# EAGLE design PCB-BI8-1x10SC3 (EAGLE 7.5.0)
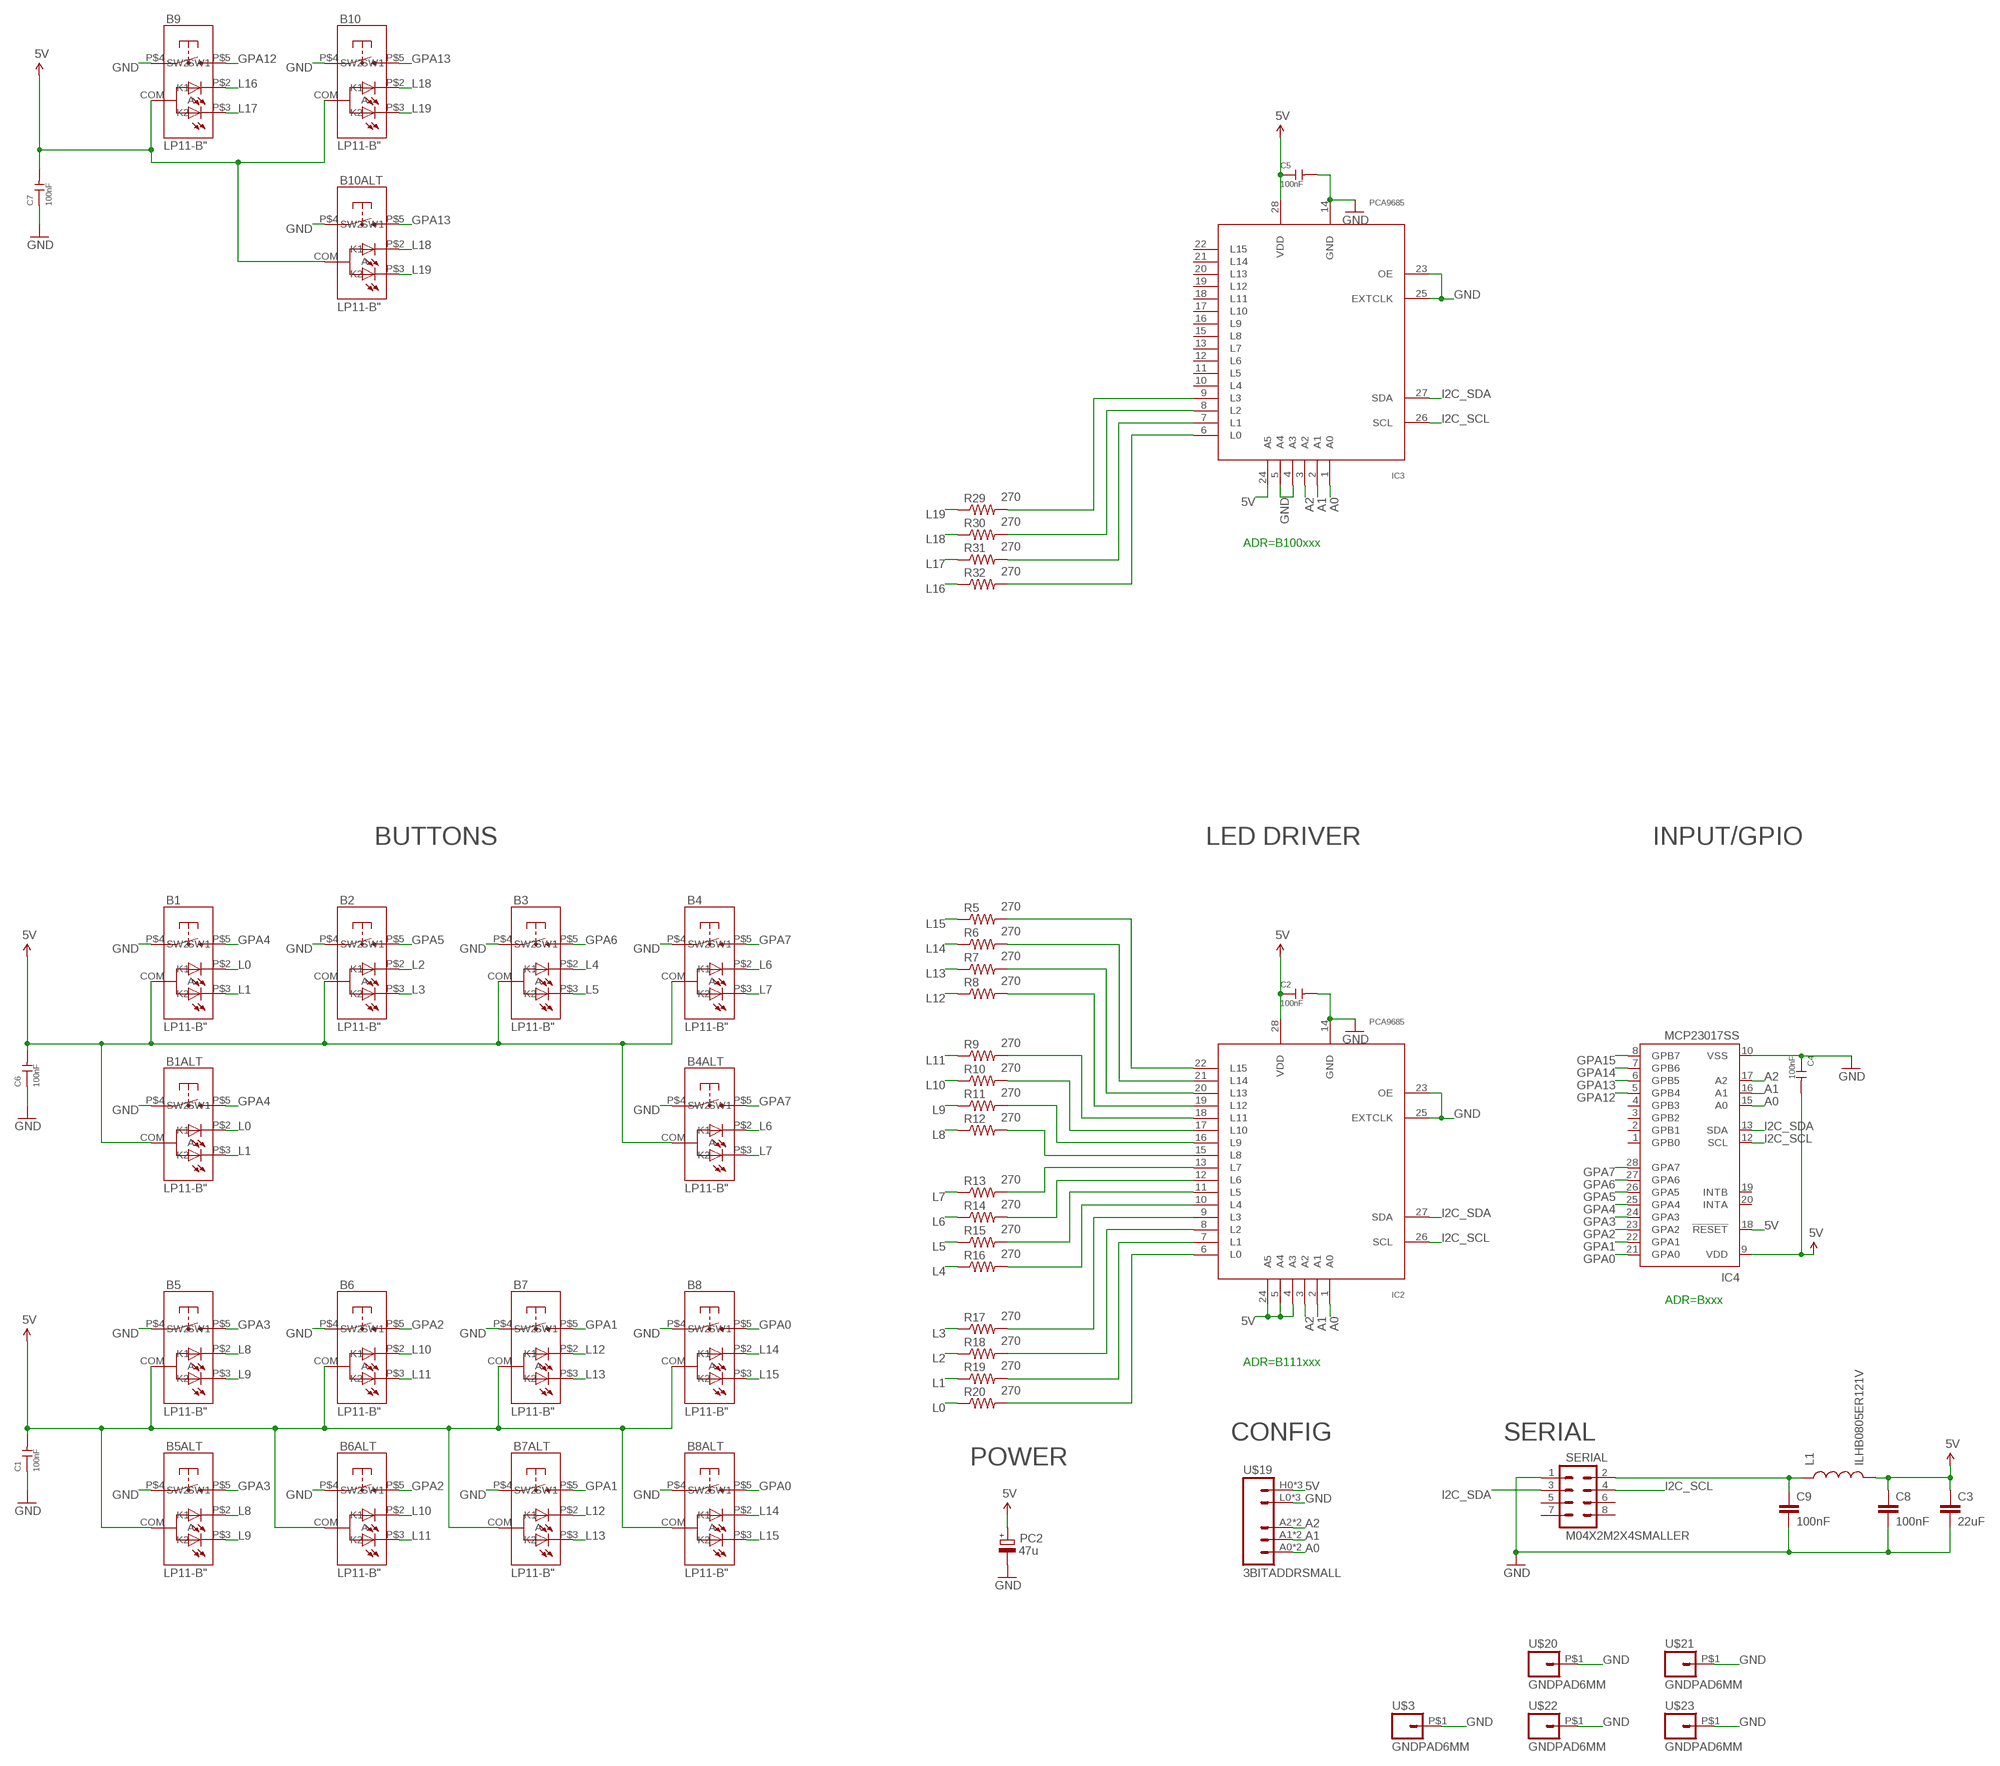
[diagram p0: schematic, sheet 1]

## Parts
B1  LP11-B"  [LP11]
B1ALT  LP11-B"  [LP11]
B2  LP11-B"  [LP11]
B3  LP11-B"  [LP11]
B4  LP11-B"  [LP11]
B4ALT  LP11-B"  [LP11]
B5  LP11-B"  [LP11]
B5ALT  LP11-B"  [LP11]
B6  LP11-B"  [LP11]
B6ALT  LP11-B"  [LP11]
B7  LP11-B"  [LP11]
B7ALT  LP11-B"  [LP11]
B8  LP11-B"  [LP11]
B8ALT  LP11-B"  [LP11]
B9  LP11-B"  [LP11]
B10  LP11-B"  [LP11]
B10ALT  LP11-B"  [LP11]
C1  100nF  CAP-0603  [C0603]
C2  100nF  CAP-0603  [C0603]
C3  22uF  CAP0805  [0805]
C4  100nF  CAP-0603  [C0603]
C5  100nF  CAP-0603  [C0603]
C6  100nF  CAP-0603  [C0603]
C7  100nF  CAP-0603  [C0603]
C8  100nF  CAP0603-CAP  [0603-CAP]
C9  100nF  CAP0603-CAP  [0603-CAP]
IC2  PCA9685  [TSSOP28]
IC3  PCA9685  [TSSOP28]
IC4  MCP23017SS  [SSOP28]
L1  ILHB0805ER121V  INDUCTOR0805  [0805]
PC2  47u  CPOL-EUD  [PANASONIC_D]
R5  270  RESISTOR0603-RES  [0603-RES]
R6  270  RESISTOR0603-RES  [0603-RES]
R7  270  RESISTOR0603-RES  [0603-RES]
R8  270  RESISTOR0603-RES  [0603-RES]
R9  270  RESISTOR0603-RES  [0603-RES]
R10  270  RESISTOR0603-RES  [0603-RES]
R11  270  RESISTOR0603-RES  [0603-RES]
R12  270  RESISTOR0603-RES  [0603-RES]
R13  270  RESISTOR0603-RES  [0603-RES]
R14  270  RESISTOR0603-RES  [0603-RES]
R15  270  RESISTOR0603-RES  [0603-RES]
R16  270  RESISTOR0603-RES  [0603-RES]
R17  270  RESISTOR0603-RES  [0603-RES]
R18  270  RESISTOR0603-RES  [0603-RES]
R19  270  RESISTOR0603-RES  [0603-RES]
R20  270  RESISTOR0603-RES  [0603-RES]
R29  270  RESISTOR0603-RES  [0603-RES]
R30  270  RESISTOR0603-RES  [0603-RES]
R31  270  RESISTOR0603-RES  [0603-RES]
R32  270  RESISTOR0603-RES  [0603-RES]
SERIAL  M04X2M2X4SMALLER  [M2X4SMALLER]
U$3  GNDPAD6MM  [3.2MMPAD6MM]
U$19  3BITADDRSMALL  [3BITADDR_SMALL]
U$20  GNDPAD6MM  [3.2MMPAD6MM]
U$21  GNDPAD6MM  [3.2MMPAD6MM]
U$22  GNDPAD6MM  [3.2MMPAD6MM]
U$23  GNDPAD6MM  [3.2MMPAD6MM]

## Nets
5V [Power]: B1.COM(A) B1ALT.COM(A) B2.COM(A) B3.COM(A) B4.COM(A) B4ALT.COM(A) B5.COM(A) B5ALT.COM(A) B6.COM(A) B6ALT.COM(A) B7.COM(A) B7ALT.COM(A) B8.COM(A) B8ALT.COM(A) B9.COM(A) B10.COM(A) B10ALT.COM(A) C1.2 C2.1 C3.1 C4.2 C5.1 C6.2 C7.2 C8.1 IC2.4(A3) IC2.5(A4) IC2.24(A5) IC2.28(VDD) IC3.24(A5) IC3.28(VDD) IC4.9(VDD) IC4.18(!RESET) L1.2 PC2.+ U$19.H0(VCC) U$19.H1(VCC) U$19.H2(VCC)
A0: IC2.1(A0) IC3.1(A0) IC4.15(A0) U$19.A0 U$19.AS0(A0)
A1: IC2.2(A1) IC3.2(A1) IC4.16(A1) U$19.A1 U$19.AS1(A1)
A2: IC2.3(A2) IC3.3(A2) IC4.17(A2) U$19.A2 U$19.AS2(A2)
GND [Power]: B1.P$4(SW1) B1ALT.P$4(SW1) B2.P$4(SW1) B3.P$4(SW1) B4.P$4(SW1) B4ALT.P$4(SW1) B5.P$4(SW1) B5ALT.P$4(SW1) B6.P$4(SW1) B6ALT.P$4(SW1) B7.P$4(SW1) B7ALT.P$4(SW1) B8.P$4(SW1) B8ALT.P$4(SW1) B9.P$4(SW1) B10.P$4(SW1) B10ALT.P$4(SW1) C1.1 C2.2 C3.2 C4.1 C5.2 C6.1 C7.1 C8.2 C9.2 IC2.14(GND) IC2.23(OE) IC2.25(EXTCLK) IC3.4(A3) IC3.5(A4) IC3.14(GND) IC3.23(OE) IC3.25(EXTCLK) IC4.10(VSS) PC2.- SERIAL.1 U$3.P$1 U$19.L0(GND) U$19.L1(GND) U$19.L2(GND) U$20.P$1 U$21.P$1 U$22.P$1 U$23.P$1
GPA0: B8.P$5(SW2) B8ALT.P$5(SW2) IC4.21(GPA0)
GPA1: B7.P$5(SW2) B7ALT.P$5(SW2) IC4.22(GPA1)
GPA2: B6.P$5(SW2) B6ALT.P$5(SW2) IC4.23(GPA2)
GPA3: B5.P$5(SW2) B5ALT.P$5(SW2) IC4.24(GPA3)
GPA4: B1.P$5(SW2) B1ALT.P$5(SW2) IC4.25(GPA4)
GPA5: B2.P$5(SW2) IC4.26(GPA5)
GPA6: B3.P$5(SW2) IC4.27(GPA6)
GPA7: B4.P$5(SW2) B4ALT.P$5(SW2) IC4.28(GPA7)
GPA12: B9.P$5(SW2) IC4.5(GPB4)
GPA13: B10.P$5(SW2) B10ALT.P$5(SW2) IC4.6(GPB5)
GPA14: IC4.7(GPB6)
GPA15: IC4.8(GPB7)
I2C_SCL: IC2.26(SCL) IC3.26(SCL) IC4.12(SCL) SERIAL.4
I2C_SDA: IC2.27(SDA) IC3.27(SDA) IC4.13(SDA) SERIAL.3
L0: B1.P$2(K1) B1ALT.P$2(K1) R20.1
L1: B1.P$3(K2) B1ALT.P$3(K2) R19.1
L2: B2.P$2(K1) R18.1
L3: B2.P$3(K2) R17.1
L4: B3.P$2(K1) R16.1
L5: B3.P$3(K2) R15.1
L6: B4.P$2(K1) B4ALT.P$2(K1) R14.1
L7: B4.P$3(K2) B4ALT.P$3(K2) R13.1
L8: B5.P$2(K1) B5ALT.P$2(K1) R12.1
L9: B5.P$3(K2) B5ALT.P$3(K2) R11.1
L10: B6.P$2(K1) B6ALT.P$2(K1) R10.1
L11: B6.P$3(K2) B6ALT.P$3(K2) R9.1
L12: B7.P$2(K1) B7ALT.P$2(K1) R8.1
L13: B7.P$3(K2) B7ALT.P$3(K2) R7.1
L14: B8.P$2(K1) B8ALT.P$2(K1) R6.1
L15: B8.P$3(K2) B8ALT.P$3(K2) R5.1
L16: B9.P$2(K1) R32.1
L17: B9.P$3(K2) R31.1
L18: B10.P$2(K1) B10ALT.P$2(K1) R30.1
L19: B10.P$3(K2) B10ALT.P$3(K2) R29.1
N$1 [Power]: C9.1 L1.1 SERIAL.2
N$4: IC2.13(L7) R13.2
N$5: IC2.12(L6) R14.2
N$7: IC2.11(L5) R15.2
N$8: IC3.9(L3) R29.2
N$9: IC2.10(L4) R16.2
N$10: IC2.9(L3) R17.2
N$11: IC2.8(L2) R18.2
N$12: IC2.7(L1) R19.2
N$13: IC3.8(L2) R30.2
N$14: IC3.7(L1) R31.2
N$15: IC3.6(L0) R32.2
N$19: IC2.6(L0) R20.2
N$20: IC2.15(L8) R12.2
N$21: IC2.16(L9) R11.2
N$22: IC2.17(L10) R10.2
N$23: IC2.18(L11) R9.2
N$24: IC2.19(L12) R8.2
N$25: IC2.20(L13) R7.2
N$26: IC2.21(L14) R6.2
N$27: IC2.22(L15) R5.2
Unconnected: IC3.10(L4) IC3.11(L5) IC3.12(L6) IC3.13(L7) IC3.15(L8) IC3.16(L9) IC3.17(L10) IC3.18(L11) IC3.19(L12) IC3.20(L13) IC3.21(L14) IC3.22(L15) IC4.1(GPB0) IC4.2(GPB1) IC4.3(GPB2) IC4.4(GPB3) IC4.19(INTB) IC4.20(INTA) SERIAL.5 SERIAL.6 SERIAL.7 SERIAL.8

## Notes on the sheet
- ADR=B100xxx
- BUTTONS | LED DRIVER | INPUT/GPIO
- ADR=Bxxx
- ADR=B111xxx
- CONFIG | SERIAL
- POWER

## Library data of the parts
B1 B1ALT B2-B4 B4ALT B5 B5ALT B6 B6ALT B7 B7ALT B8 B8ALT B9 B10 B10ALT = SKAARHOJ:LP11-B
C1 C2 C4-C7 = OPL:CAP: Ceramic Capacitors
C3 C8 C9 = SparkFun:CAP: Capacitor Standard 0603 ceramic capacitor, and 0.1" leaded capacitor.
IC2 IC3 = wsmith:PCA9685
IC4 = microchip:MCP23017: http://ww1.microchip.com/downloads/en/DeviceDoc/21952a.pdf Source: http://ww1.microchip.com/downloads/en/DeviceDoc/21952a.pdf; MF: MICROCHIP; MPN: MCP23017-E/SS; OC_FARNELL: 1467674; OC_NEWARK: 31K2960
L1 = SparkFun:INDUCTOR: Inductors Basic Inductor/Choke - 0603 and 1206. Footprints are not proven and vary greatly between part numbers.
PC2 = rcl:CPOL-EU: POLARIZED CAPACITOR, European symbol
R5-R20 R29-R32 = SparkFun-Passives:RESISTOR: Resistor Basic schematic elements and footprints for 0603, 1206, and PTH resistors.
SERIAL = SKAARHOJ:M04X2
U$3 U$20-U$23 = SKAARHOJ:GNDPAD
U$19 = SKAARHOJ:3BITADDR

## Net classes
0 default: width 0.152 mm, drill 0.406 mm, clearance 0.152 mm
1 Power: width 0.203 mm, drill 0.406 mm, clearance 0.152 mm

## Board
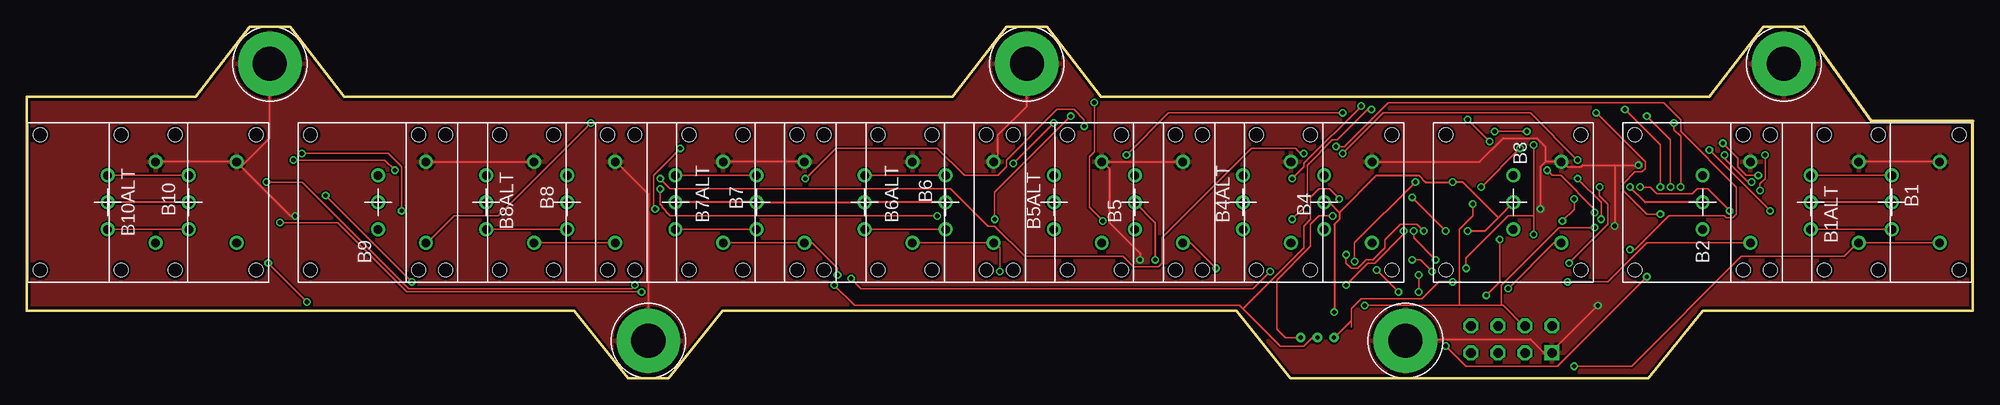
[diagram p1: board, top side]
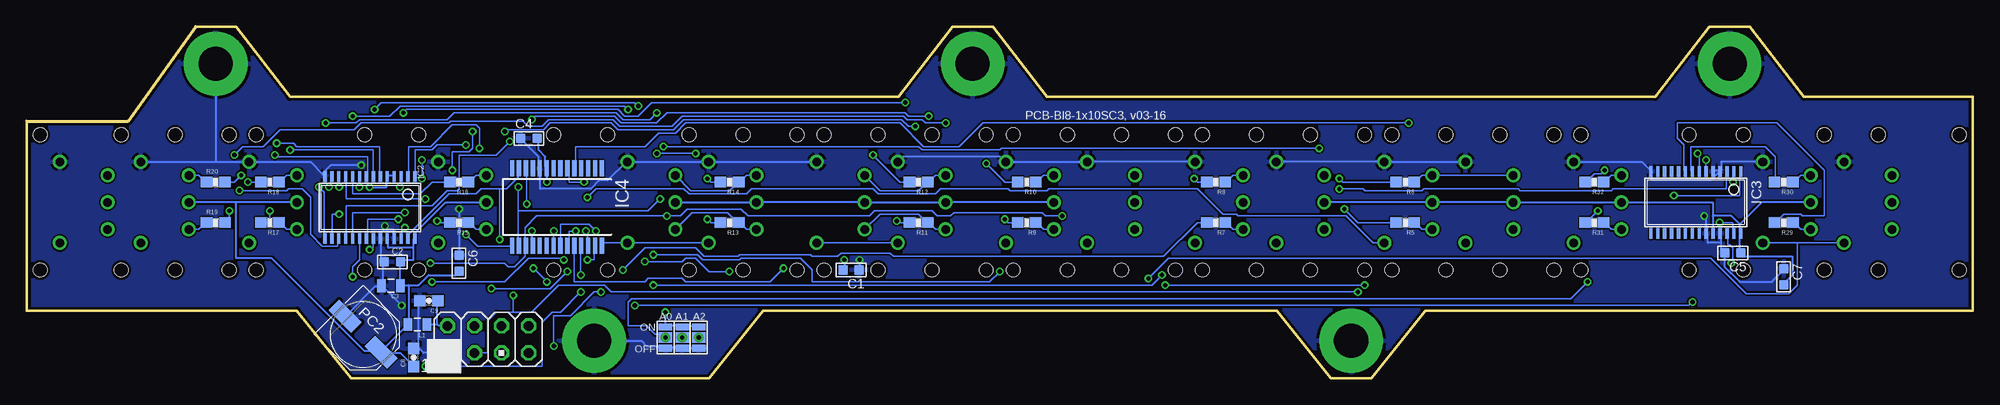
[diagram p2: board, bottom side, seen from below]

Size 182.88 x 33.02 mm. Coordinates in mm from the lower left corner, seen from the top.
Outline: 0,26.42 15.88,26.42 20.95,33.02 24.77,33.02 29.84,26.42 87,26.42 92.08,33.02 95.89,33.02 100.97,26.42 158.12,26.42 163.19,33.02 167,33.02 173.35,24.13 182.88,24.13 182.88,6.35 157.48,6.35 152.4,0 118.75,0 113.67,6.35 65.41,6.35 60.33,0 56.52,0 51.44,6.35 0,6.35 0,26.42
Copper layers (1*16): Top 0.035mm / dielectric 1.5mm / Bottom 0.035mm
Design rules "Fusion_eagle_rule_v1.1": minimum track width 6mil, minimum drill 12mil, track to track 6mil, track to pad 6mil, pad to pad 6mil, via to via 6mil, smd to smd 0mil, copper to edge 10mil, drill to drill 10mil, minimum pad ring 10mil, minimum via ring 6mil, stop-mask expansion 2mil, vias tented up to drill 100mil, thermal gap 10mil

### Footprints (pad centres in the part's own frame; a part is rotated, then mirrored left to right if it is on the bottom)
LP11 = drill 0.8: COM 0,0; P$2 0,2.54; P$3 0,-2.54; P$4 4.5,3.81; P$5 4.5,-3.81 | hole 1.3: -6.35,6.35; 6.35,6.35; 6.35,-6.35; -6.35,-6.35
C0603 = smd 0.889 x 0.889: 1 -0.762,0; 2 0.762,0
0805 = smd 0.8 x 1.2: 1 -0.9,0; 2 0.9,0
0603-CAP = smd 1.1 x 1: 1 -0.85,0; 2 0.85,0
TSSOP28 = smd 0.305 x 0.991: 1 -4.225,-2.918; 2 -3.575,-2.918; 3 -2.925,-2.918; 4 -2.275,-2.918; 5 -1.625,-2.918; 6 -0.975,-2.918; 7 -0.325,-2.918; 8 0.325,-2.918; 9 0.975,-2.918; 10 1.625,-2.918; 11 2.275,-2.918; 12 2.925,-2.918; 13 3.575,-2.918; 14 4.225,-2.918; 15 4.225,2.918; 16 3.575,2.918; 17 2.925,2.918; 18 2.275,2.918; 19 1.625,2.918; 20 0.975,2.918; 21 0.325,2.918; 22 -0.325,2.918; 23 -0.975,2.918; 24 -1.625,2.918; 25 -2.275,2.918; 26 -2.925,2.918; 27 -3.575,2.918; 28 -4.225,2.918
SSOP28 = smd 0.4 x 1.5: 1 -4.225,-3.625; 2 -3.575,-3.625; 3 -2.925,-3.625; 4 -2.275,-3.625; 5 -1.625,-3.625; 6 -0.975,-3.625; 7 -0.325,-3.625; 8 0.325,-3.625; 9 0.975,-3.625; 10 1.625,-3.625; 11 2.275,-3.625; 12 2.925,-3.625; 13 3.575,-3.625; 14 4.225,-3.625; 15 4.225,3.625; 16 3.575,3.625; 17 2.925,3.625; 18 2.275,3.625; 19 1.625,3.625; 20 0.975,3.625; 21 0.325,3.625; 22 -0.325,3.625; 23 -0.975,3.625; 24 -1.625,3.625; 25 -2.275,3.625; 26 -2.925,3.625; 27 -3.575,3.625; 28 -4.225,3.625
PANASONIC_D = smd 3 x 1.4: + 2.4,0; - -2.4,0
0603-RES = smd 1.1 x 1: 1 -0.85,0; 2 0.85,0
M2X4SMALLER = drill 0.9 square: 1 -1.27,3.81 | drill 0.9 octagon: 2 1.27,3.81; 3 -1.27,1.27; 4 1.27,1.27; 5 -1.27,-1.27; 6 1.27,-1.27; 7 -1.27,-3.81; 8 1.27,-3.81
3.2MMPAD6MM = drill 3.2 pad 6: P$1 0,0
3BITADDR_SMALL = drill 0.4: A0 -1.565,0; A1 0,0; A2 1.565,0 | smd 1.27 x 1: AS0 -1.565,0; AS1 0,0; AS2 1.565,0 | smd 1.27 x 0.635: H0 -1.565,1; H1 0,1; H2 1.565,1; L0 -1.565,-1; L1 0,-1; L2 1.565,-1

### Placement (x,y rotation side)
B1  175.26,16.51 0 top
B1ALT  167.64,16.51 0 top
B2  157.48,16.51 0 top
B3  139.7,16.51 0 top
B4  121.92,16.51 0 top
B4ALT  114.3,16.51 0 top
B5  104.14,16.51 0 top
B5ALT  96.52,16.51 0 top
B6  86.36,16.51 0 top
B6ALT  78.74,16.51 0 top
B7  68.58,16.51 0 top
B7ALT  60.96,16.51 0 top
B8  50.8,16.51 0 top
B8ALT  43.18,16.51 0 top
B9  33.02,16.51 0 top
B10  15.24,16.51 0 top
B10ALT  7.62,16.51 0 top
C1  105.41,10.16 180 bottom
C2  148.51,10.92 180 bottom
C3  148.64,8.69 180 bottom
C4  135.69,22.53 0 bottom
C5  22.56,11.76 180 bottom
C6  142.24,10.79 270 bottom
C7  17.78,9.53 270 bottom
C8  146.51,1.93 90 bottom
C9  145.08,7.26 180 bottom
IC2  150.62,16.03 180 bottom
IC3  26.04,16.51 180 bottom
IC4  133.05,16.08 180 bottom
L1  146.15,5.03 180 bottom
PC2  151.26,4.11 315 bottom
R5  53.34,14.61 180 bottom
R6  53.34,18.41 180 bottom
R7  71.12,14.61 180 bottom
R8  71.12,18.41 180 bottom
R9  88.9,14.61 180 bottom
R10  88.9,18.41 180 bottom
R11  99.06,14.61 180 bottom
R12  99.06,18.41 180 bottom
R13  116.84,14.61 180 bottom
R14  116.84,18.41 180 bottom
R15  142.24,14.61 180 bottom
R16  142.24,18.41 180 bottom
R17  160.02,14.61 180 bottom
R18  160.02,18.41 180 bottom
R19  165.1,14.61 0 bottom
R20  165.1,18.41 0 bottom
R29  17.78,14.61 180 bottom
R30  17.78,18.41 180 bottom
R31  35.56,14.61 180 bottom
R32  35.56,18.41 180 bottom
SERIAL  139.52,3.63 90 bottom
U$3  22.86,29.52 0 top
U$19  121.28,3.81 0 bottom
U$20  58.42,3.5 0 top
U$21  129.54,3.5 0 top
U$22  165.1,29.52 0 top
U$23  93.98,29.52 0 top

### Tracks (layer width: path | path; a pad name or v marks a point on that pad's centre or on a via)
5V  (via drill 0.41)
  Top 0.203: B1.COM B1ALT.COM | v150.65,17.94 152.08,16.51 B2.COM | v135.41,13.81 137,13.81 138.27,15.08 | B3.COM 138.27,15.08 | 138.27,15.08 134.94,18.41 v133.99,18.41 131.44,18.41 130.81,19.05 126.84,19.05 123.35,15.56 | B10.COM B10ALT.COM | 123.35,15.56 122.4,16.51 B4.COM | v106.05,11.11 106.05,14.61 B5.COM | B6.COM B6ALT.COM B7.COM B7ALT.COM | v122.87,6.19 122.87,14.45 123.35,14.92 123.35,15.56
  Bottom 0.203: IC2.4 148.43,19.05 148.91,19.05 IC2.5 149.07,18.89 149.07,17.94 v150.65,17.94 | B2.COM 163.19,16.51 | 163.19,16.51 B1ALT.COM | C4.2 134.78,22.38 134.78,21.43 134.14,20.8 134.14,19.84 IC4.9 133.99,19.68 v133.99,18.41 | v135.41,13.81 135.41,12.54 IC4.18 | C8.1 146.53,1.11 147.8,2.38 149.54,2.38 PC2.+ | PC2.+ 149.54,2.54 147.16,4.92 L1.2 147,5.08 147,8.73 | 147,8.73 147.64,8.73 C3.1 147.8,8.73 147.8,10.79 C2.1 147.64,10.95 147.48,11.11 146.53,11.11 146.53,12.22 | 147,8.73 146.05,8.73 145.1,9.68 142.56,9.68 142.24,10 C6.2 | 146.53,12.22 146.53,13.02 IC2.28 146.37,13.18 146.37,13.65 143.51,16.51 B3.COM | 146.53,12.22 148.91,12.22 148.91,13.02 IC2.24 | 163.19,16.51 163.19,11.27 159.86,11.27 151.13,2.54 149.7,2.54 PC2.+ | C7.2 17.78,8.89 16.99,9.68 16.99,11.43 21.43,11.43 21.75,11.75 C5.1 21.91,11.91 21.91,13.49 IC3.28 21.91,13.65 21.91,14.45 | 24.45,15.24 24.45,13.65 IC3.24 | 24.45,15.24 22.7,15.24 21.91,14.45 | 21.91,14.45 19.84,16.51 B10.COM | B4.COM B4ALT.COM B5.COM B5ALT.COM B6.COM | v106.05,11.11 106.05,10.16 C1.2 | B7ALT.COM B8.COM B8ALT.COM B9.COM 24.45,16.51 24.45,15.24 | 121.28,4.92 119.86,4.92 U$19.H2 | 121.28,4.92 122.71,4.92 U$19.H0 122.87,4.92 v122.87,6.19 | 121.28,4.92 U$19.H1
A0  (via drill 0.41)
  Top 0.152: v141.6,13.49 141.6,15.24 | 141.6,15.24 v141.6,21.91 | v36.2,9.05 v28.1,17.14 | 141.6,15.24 139.22,15.24 135.25,11.27 v135.25,10.32 | v133.99,9.05 132.72,9.05 131.13,7.46 125.41,7.46 124.46,6.51 124.46,5.4 | 124.46,4.76 124.46,5.4 | 124.46,5.4 122.87,3.81 U$19.AS0
  Bottom 0.152: v141.6,21.91 144.3,21.91 144.78,21.43 146.37,21.43 146.37,19.05 IC2.1 | v141.6,13.49 140.49,12.38 137.32,12.38 IC4.15 | v28.1,17.14 21.91,17.14 21.91,19.37 IC3.1 | v36.2,9.05 37.78,7.46 126.05,7.46 126.36,7.14 126.36,4.92 124.62,4.92 123.83,4.13 123.19,4.13 122.87,3.81 U$19.AS0 | v133.99,9.05 v135.25,10.32
A1  (via drill 0.41)
  Top 0.152: v136.68,17.94 v140.34,21.59 | v22.54,18.41 25.88,18.41 35.88,8.41 56.83,8.41 v57.15,8.73 | v75.88,8.73 77.79,6.83 113.98,6.83 114.3,6.51 | 114.3,6.51 117.79,3.02 120.02,3.02 120.81,3.81 U$19.AS1 | v123.35,16.83 122.4,17.78 121.44,17.78 120.65,16.99 120.65,14.92 120.02,14.29 120.02,12.22 114.3,6.51
  Bottom 0.152: v140.34,21.59 140.34,23.5 140.65,23.81 142.88,23.81 144.94,21.75 147,21.75 147,19.05 IC2.2 | 136.68,15.72 136.68,12.54 IC4.16 | 136.68,15.72 v136.68,17.94 | v22.54,18.41 22.54,19.37 IC3.2 | v75.88,8.73 v57.15,8.73 | 136.68,15.72 124.46,15.72 v123.35,16.83
A2  (via drill 0.41)
  Top 0.152: v59.53,17.78 59.53,16.35 59.69,16.19 59.69,16.03 60.48,15.24 v85.57,15.24 | v147.8,17.94 147.8,17.14 148.59,16.35 148.59,14.45 v144.94,10.79 | v122.71,15.24 121.44,15.24 120.65,14.45 120.65,12.38 117.47,9.21 117.47,4.6 118.27,3.81 U$19.AS2
  Bottom 0.152: v59.53,17.78 57.31,17.78 57.15,17.62 51.75,17.62 51.59,17.78 42.7,17.78 42.55,17.62 33.97,17.62 33.81,17.78 23.18,17.78 23.18,19.37 IC3.3 | v85.57,15.24 87.15,15.24 87.47,15.56 95.73,15.56 96.04,15.24 97.31,15.24 97.79,15.72 103.19,15.72 103.66,15.24 115.09,15.24 115.73,15.88 120.81,15.88 121.44,15.24 v122.71,15.24 134.94,15.24 136.05,14.13 136.05,12.54 IC4.17 136.05,12.38 136.05,11.43 137,10.48 137.64,10.48 137.95,10.79 v144.94,10.79 | v147.8,17.94 147.8,18.89 IC2.3 | 119.86,3.81 U$19.AS2
GND  (via drill 0.41)
  Top 0.203: 143.19,2.38 142.56,2.38 141.29,3.65 129.54,3.65 U$21.P$1 | 143.19,2.38 v147.64,6.83 | 143.19,2.38 SERIAL.1 | B1.P$4 B1ALT.P$4 | v104.62,11.11 104.62,11.75 101.76,14.61 101.76,19.68 101.12,20.32 | 101.12,20.32 B5.P$4 | 101.12,20.32 B5ALT.P$4 | v142.24,15.88 142.24,19.84 142.72,20.32 | 142.72,20.32 B3.P$4 144.3,20.32 144.78,19.84 146.05,19.84 146.21,20 149.22,20 | 142.72,20.32 142.72,21.75 141.92,22.54 138.75,22.54 136.53,20.32 B4.P$4 | 149.22,20 v151.45,20 | 149.22,20 v149.22,14.29 | B7.P$4 B7ALT.P$4 | 19.68,20.32 B10ALT.P$4 | v25.24,15.24 24.77,15.24 20.16,19.84 | 19.68,20.32 20.16,19.84 | 19.68,20.32 B10.P$4 20.16,19.84 | B9.P$4 B8ALT.P$4 | U$20.P$1 58.42,17.3 55.4,20.32 B8.P$4 | U$3.P$1 22.86,22.54 20.16,19.84 | U$23.P$1 93.98,25.56 91.28,22.86 91.28,20.64 90.96,20.32 B6.P$4
  Bottom 0.203: 149.22,13.97 148.43,13.97 148.43,13.18 IC2.25 | 149.22,13.97 149.54,13.65 149.54,13.18 IC2.23 149.54,13.02 149.54,10.95 149.38,10.95 C2.2 149.38,10.79 149.38,8.73 C3.2 | PC2.- 152.88,5.87 150.18,8.57 149.54,8.57 C3.2 | 146.05,2.86 146.05,7.14 C9.2 | 146.05,2.86 146.37,2.86 C8.2 146.05,2.86 | 146.05,2.86 145.57,2.38 143.35,2.38 SERIAL.1 | U$21.P$1 125.09,3.49 124.62,3.02 123.03,3.02 122.87,2.86 U$19.L0 122.71,2.86 121.28,2.86 | v147.64,6.83 149.38,8.57 C3.2 | 155.1,19.21 156.21,20.32 B2.P$4 165.1,20.32 | 155.1,19.21 154.94,19.05 IC2.14 | B1ALT.P$4 165.1,20.32 | U$22.P$1 165.1,20.32 | v104.62,11.11 104.62,10.16 C1.1 | v142.24,15.88 C6.1 | C4.1 136.37,22.38 134.78,20.8 134.78,19.84 IC4.10 134.62,19.68 134.62,17.78 129.86,17.78 129.06,18.57 128.27,18.57 126.52,20.32 B4.P$4 B4ALT.P$4 B5.P$4 | 155.1,19.21 154.31,20 v151.45,20 | v149.22,14.29 149.22,13.97 | B8ALT.P$4 B8.P$4 B7ALT.P$4 | B9.P$4 31.11,20.32 30.32,19.53 IC3.14 30.16,19.37 30.16,18.57 24.61,18.57 23.81,19.37 IC3.4 | C7.1 17.78,10.16 18.89,9.05 21.91,9.05 23.34,10.48 23.34,11.75 C5.2 23.34,11.91 23.65,11.91 23.65,12.7 | 23.65,12.7 23.65,13.49 IC3.25 | 23.65,12.7 24.92,12.7 24.92,13.49 IC3.23 25.08,13.65 25.08,15.24 v25.24,15.24 | IC3.4 23.81,19.53 24.29,19.53 IC3.5 | B10.P$4 23.65,20.32 23.65,19.53 IC3.4 | B7.P$4 B6ALT.P$4 B6.P$4 90.96,20.32 91.44,20.8 100.49,20.8 100.97,20.32 B5ALT.P$4 | 121.28,2.86 119.86,2.86 U$19.L2 | 121.28,2.86 U$19.L1
  pour Top: 0,0 182.88,0 182.88,33.02 0,33.02
  pour Bottom: 0,0 182.88,0 182.88,33.02 0,33.02
GPA0  (via drill 0.41)
  Top 0.152: v130.18,16.99 v133.35,13.81 | B8.P$5 B8ALT.P$5
  Bottom 0.152: v133.35,13.81 133.35,12.54 IC4.21 | v130.18,16.99 129.38,17.78 121.13,17.78 120.65,17.3 115.25,17.3 114.78,17.78 103.35,17.78 102.87,17.3 97.47,17.3 97,17.78 90.65,17.78 90.49,17.62 87,17.62 86.84,17.78 72.87,17.78 70.48,15.4 69.22,15.4 69.06,15.24 58.9,15.24 56.36,12.7 B8.P$5
GPA1  (via drill 0.41)
  Top 0.152: v129.38,13.81 129.38,13.49 126.68,10.79 126.05,10.79 v123.98,8.73 | v76.2,9.68 76.2,10.32 73.82,12.7 B7.P$5 B7ALT.P$5
  Bottom 0.152: v129.38,13.81 130.02,14.45 132.72,14.45 132.72,12.54 IC4.22 | v123.98,8.73 77.15,8.73 v76.2,9.68
GPA2  (via drill 0.41)
  Top 0.152: v131.29,13.81 130.65,14.45 129.06,14.45 127.64,13.02 127.64,12.22 126.52,11.11 125.89,11.11 125.09,10.32 124.46,10.32 123.98,10.79 v123.98,11.59 | v91.44,10 91.44,12.22 90.96,12.7 B6.P$5 B6ALT.P$5
  Bottom 0.152: v131.29,13.81 131.92,13.81 131.92,12.54 IC4.23 | v123.98,11.59 119.86,11.59 119.38,11.11 115.89,11.11 115.73,11.27 110.17,11.27 109.06,10.16 109.06,9.05 92.39,9.05 v91.44,10
GPA3  (via drill 0.41)
  Top 0.152: v111.76,10.32 109.38,12.7 B5.P$5
  Bottom 0.152: v111.76,10.32 113.03,9.05 120.97,9.05 121.28,9.37 124.46,9.37 124.78,9.05 131.44,9.05 131.44,12.38 IC4.24 | B5.P$5 B5ALT.P$5
GPA4  (via drill 0.41)
  Top 0.152: v130.81,8.1 v130.81,9.68 | v145.41,1.11 150.81,1.11 161.13,11.43 170.81,11.43 172.09,12.7 B1ALT.P$5 B1.P$5
  Bottom 0.152: v130.81,9.68 130.81,12.38 IC4.25 | v130.81,8.1 132.72,6.19 133.51,6.19 134.46,5.24 134.46,1.11 v145.41,1.11
GPA5  (via drill 0.41)
  Top 0.152: v130.33,13.81 130.33,13.18 v132.4,11.11 | v144.78,9.05 148.59,9.05 152.24,12.7 B2.P$5
  Bottom 0.152: v130.33,13.81 130.18,13.81 130.18,12.54 IC4.26 | v132.4,11.11 132.56,11.27 135.73,11.27 137.95,9.05 v144.78,9.05
GPA6  (via drill 0.41)
  Top 0.152: v130.18,11.11 130.97,11.11 v132.08,10 | v139.22,8.41 143.51,12.7 B3.P$5
  Bottom 0.152: v130.18,11.11 129.54,11.11 129.54,12.38 IC4.27 | v132.08,10 133.67,8.41 v139.22,8.41
GPA7
  Bottom 0.152: IC4.28 128.75,12.54 128.59,12.7 B4.P$5 B4ALT.P$5
GPA12  (via drill 0.41)
  Top 0.152: v53.02,23.97 44.29,15.24 40.16,15.24 37.62,12.7 B9.P$5
  Bottom 0.152: v53.02,23.97 93.03,23.97 95.25,21.75 98.58,21.75 100.81,23.97 120.97,23.97 121.92,23.02 123.51,23.02 124.78,21.75 131.29,21.75 131.29,19.84 IC4.5
GPA13  (via drill 0.41)
  Top 0.152: v130.49,18.41 124.78,12.7 v124.78,10.95 | v116.84,10 115.25,8.41 78.42,8.41 v77.47,9.37
  Bottom 0.152: v130.49,18.41 131.92,18.41 131.92,19.68 IC4.6 | v124.78,10.95 121.28,10.95 120.97,11.27 120.02,11.27 118.75,10 v116.84,10 | v77.47,9.37 75.56,11.27 24.61,11.27 21.27,7.94 17.3,7.94 16.51,8.73 16.51,12.7 | B10.P$5 16.51,12.7 | 16.51,12.7 B10ALT.P$5
I2C_SCL  (via drill 0.41)
  Top 0.152: v26.35,7.14 v22.7,10.79 | 138.59,6.83 138.75,6.83 140.65,4.92 SERIAL.4 | 138.59,6.83 134.62,6.83 | 134.62,6.83 v125.73,6.83 | v147.32,14.13 143.99,14.13 138.59,8.73 138.59,6.83 | v135.89,16.35 135.89,15.24 134.62,13.97 134.62,6.83
  Bottom 0.152: v22.7,10.79 22.54,10.79 22.54,12.22 22.86,12.54 23.02,12.54 23.02,13.49 IC3.26 | v26.35,7.14 26.67,6.83 v125.73,6.83 | v147.32,14.13 147.64,14.13 147.64,13.18 IC2.26 | v135.89,16.35 135.89,19.68 IC4.12
I2C_SDA  (via drill 0.41)
  Top 0.152: v23.81,14.61 29.21,14.61 35.72,8.1 v57.78,8.1 | v138.43,13.02 138.43,9.05 v137.16,7.78
  Bottom 0.152: 138.43,17.78 137.79,17.78 136.68,18.89 136.68,19.68 IC4.13 | 138.43,17.78 140.18,17.78 140.65,17.3 143.19,17.3 147,13.49 147,13.18 IC2.27 | v23.81,14.61 22.54,14.61 22.54,13.65 IC3.27 | v57.78,8.1 127.95,8.1 128.59,8.73 132.87,8.73 135.41,6.19 137.16,6.19 | 137.16,6.19 138.75,6.19 139.54,5.4 139.54,2.38 140.65,2.38 SERIAL.3 | v138.43,13.02 138.43,17.78 | 137.16,6.19 v137.16,7.78
L0
  Top 0.152: B1.P$2 B1ALT.P$2
  Bottom 0.152: B1ALT.P$2 166.69,19.05 166.05,18.41 R20.1
L1
  Top 0.152: B1.P$3 B1ALT.P$3
  Bottom 0.152: B1ALT.P$3 166.69,13.97 166.05,14.61 R19.1
L2
  Bottom 0.152: B2.P$2 158.43,19.05 159.07,18.41 R18.1
L3
  Bottom 0.152: B2.P$3 158.43,13.97 159.07,14.61 R17.1
L4
  Bottom 0.152: B3.P$2 140.65,19.05 141.29,18.41 R16.1
L5
  Bottom 0.152: B3.P$3 140.65,13.97 141.29,14.61 R15.1
L6
  Bottom 0.152: B4ALT.P$2 115.25,19.05 115.89,18.41 R14.1 116.05,18.41 116.84,17.62 120.49,17.62 B4.P$2
L7
  Bottom 0.152: B4ALT.P$3 115.25,13.97 115.89,14.61 R13.1 116.05,14.61 117,15.56 120.33,15.56 B4.P$3
L8
  Bottom 0.152: B5ALT.P$2 97.47,19.05 98.11,18.41 R12.1 98.27,18.41 99.06,17.62 102.71,17.62 B5.P$2
L9
  Bottom 0.152: B5ALT.P$3 97.47,13.97 98.11,14.61 R11.1 98.27,14.61 99.06,15.4 102.71,15.4 B5.P$3
L10
  Top 0.152: B6.P$2 B6ALT.P$2
  Bottom 0.152: B6.P$2 87.31,19.05 87.95,18.41 R10.1
L11
  Top 0.152: B6.P$3 B6ALT.P$3
  Bottom 0.152: B6.P$3 87.31,13.97 87.95,14.61 R9.1
L12
  Top 0.152: B7.P$2 B7ALT.P$2
  Bottom 0.152: B7.P$2 69.53,19.05 70.17,18.41 R8.1
L13
  Top 0.152: B7.P$3 B7ALT.P$3
  Bottom 0.152: B7.P$3 69.53,13.97 70.17,14.61 R7.1
L14
  Bottom 0.152: R6.1 52.39,18.41 51.75,19.05 B8.P$2 B8ALT.P$2
L15
  Top 0.152: B8.P$3 B8ALT.P$3
  Bottom 0.152: B8.P$3 51.75,13.97 52.39,14.61 R5.1
L16
  Bottom 0.152: B9.P$2 33.97,19.05 34.61,18.41 R32.1
L17
  Bottom 0.152: B9.P$3 33.97,13.97 34.61,14.61 R31.1
L18
  Top 0.152: B10.P$2 B10ALT.P$2
  Bottom 0.152: B10.P$2 16.19,19.05 16.83,18.41 R30.1
L19
  Top 0.152: B10.P$3 B10ALT.P$3
  Bottom 0.152: B10.P$3 16.19,13.97 16.83,14.61 R29.1
N$1
  Bottom 0.203: 144.3,5.08 144.3,7.14 C9.1 | 144.3,5.08 145.1,5.08 L1.1 | 144.3,5.08 144.15,4.92 143.35,4.92 SERIAL.2
N$4  (via drill 0.41)
  Top 0.152: v154.46,17.94 154.46,22.38 v152.24,24.61 | v126.36,25.24 126.05,25.24 123.19,22.38 122.71,22.38 120.33,20 120.33,16.35 v118.9,14.92
  Bottom 0.152: v154.46,17.94 154.31,17.94 154.31,18.89 IC2.13 | v152.24,24.61 148.75,24.61 147.8,25.56 126.68,25.56 v126.36,25.24 | v118.9,14.92 118.59,14.61 R13.2
N$5  (via drill 0.41)
  Top 0.152: v153.51,17.94 153.51,21.91 v150.18,25.24 | v125.41,25.56 120.02,20.16 120.02,19.84 v118.9,18.73
  Bottom 0.152: v153.51,17.94 153.51,18.89 IC2.12 | v150.18,25.24 149.54,25.88 125.73,25.88 v125.41,25.56 | v118.9,18.73 118.59,18.41 R14.2
N$7  (via drill 0.41)
  Top 0.152: v145.41,16.83 145.41,15.88 v144.3,14.76
  Bottom 0.152: v145.41,16.83 152.88,16.83 152.88,18.89 IC2.11 | v144.3,14.76 144.15,14.61 R15.2
N$8
  Bottom 0.152: IC3.9 27.15,19.53 27.15,21.91 27.78,22.54 27.78,23.97 18.41,23.97 13.97,19.53 13.97,15.24 16.03,15.24 16.19,15.4 17.78,15.4 18.57,14.61 R29.2
N$9
  Bottom 0.152: R16.2 144.78,18.41 145.89,17.3 152.24,17.3 152.24,18.89 IC2.10
N$10  (via drill 0.41)
  Top 0.152: v151.61,17.94 152.56,17.94 153.19,17.3 156.53,17.3 157,17.78 157.96,17.78 v160.02,15.72
  Bottom 0.152: v151.61,17.94 151.61,18.89 IC2.9 | v160.02,15.72 160.02,14.61 R17.2
N$11  (via drill 0.41)
  Top 0.152: v159.54,20.95 159.54,20.64 161.77,18.41 v162.08,18.41
  Bottom 0.152: v159.54,20.95 159.38,20.8 150.81,20.8 150.81,19.05 IC2.8 | R18.2 v162.08,18.41
N$12  (via drill 0.41)
  Top 0.152: v163.83,15.72 v158.12,21.43
  Bottom 0.152: v158.12,21.43 150.34,21.43 150.34,19.05 IC2.7 | v163.83,15.72 163.83,14.61 R19.2
N$13
  Bottom 0.152: IC3.8 26.51,19.53 26.51,21.75 19.53,21.75 18.57,20.8 18.57,18.41 R30.2
N$14  (via drill 0.41)
  Top 0.152: v25.88,21.11 33.97,21.11 35.24,19.84 v35.24,15.72
  Bottom 0.152: v25.88,21.11 25.72,21.11 25.72,19.53 IC3.7 | v35.24,15.72 36.35,14.61 R31.2
N$15  (via drill 0.41)
  Top 0.152: v25.08,20.48 33.66,20.48 v34.61,19.53
  Bottom 0.152: v25.08,20.48 25.08,19.53 IC3.6 | v34.61,19.53 34.92,19.21 35.56,19.21 36.35,18.41 R32.2
N$19  (via drill 0.41)
  Top 0.152: v159.38,22.07 160.81,20.64 160.81,19.84 161.61,19.05 v162.72,19.05
  Bottom 0.152: v159.38,22.07 157.8,22.07 157.48,21.75 149.7,21.75 149.7,19.05 IC2.6 | v162.72,19.05 163.35,18.41 R20.2
N$20  (via drill 0.41)
  Top 0.152: v155.42,17.94 155.42,22.7 154.78,23.34 v154.78,23.97 | v123.67,24.92 107.31,24.92 v103.35,20.95
  Bottom 0.152: v155.42,17.94 154.94,17.46 154.94,13.18 IC2.15 | v154.78,23.97 151.92,23.97 151.61,24.29 143.35,24.29 142.72,24.92 127.48,24.92 126.84,24.29 124.3,24.29 v123.67,24.92 | v103.35,20.95 100.81,18.41 R12.2
N$21  (via drill 0.41)
  Top 0.152: v153.51,15.4 152.24,15.4 150.02,17.62 150.02,18.26 151.13,19.37 151.76,19.37 152.08,19.68 152.08,20.32 v147.48,24.92 | v100.33,25.88 100.33,21.27 99.85,20.8 99.85,16.03 v101.12,14.76
  Bottom 0.152: v153.51,15.4 154.15,15.4 154.15,13.18 IC2.16 | v147.48,24.92 147.16,25.24 127.32,25.24 126.68,24.61 125.41,24.61 124.14,25.88 v100.33,25.88 | v101.12,14.76 100.97,14.61 R11.2
N$22  (via drill 0.41)
  Top 0.152: v162.88,17.62 162.88,18.26 163.35,18.73 v163.35,20.95 | v92.71,20.16 v96.52,23.97
  Bottom 0.152: v162.88,17.62 158.43,17.62 158.27,17.78 157,17.78 156.21,16.99 156.21,13.49 155.1,12.38 153.67,12.38 153.67,13.02 IC2.17 | v163.35,20.95 162.56,21.75 160.66,21.75 159.07,23.34 152.08,23.34 151.45,23.97 143.19,23.97 143.03,24.13 136.21,24.13 135.73,23.65 134.46,23.65 133.83,24.29 127.79,24.29 127.16,23.65 122.24,23.65 121.28,24.61 100.49,24.61 100.17,24.29 98.74,24.29 98.42,23.97 v96.52,23.97 | v92.71,20.16 90.96,18.41 R10.2
N$23  (via drill 0.41)
  Top 0.152: v135.41,24.29 v137.48,22.23 | v98.11,24.61 90.96,17.46 v90.96,14.92
  Bottom 0.152: v137.48,22.23 138.75,20.95 142.24,20.95 142.24,17.78 142.4,17.62 143.35,17.62 144.78,16.19 152.88,16.19 152.88,13.18 IC2.18 | v135.41,24.29 135.1,24.61 127.64,24.61 127,23.97 123.67,23.97 122.71,24.92 100.33,24.92 100.01,24.61 v98.11,24.61 | v90.96,14.92 90.65,14.61 R9.2
N$24  (via drill 0.41)
  Top 0.152: v147.32,15.56 147.32,15.88 144.15,19.05 143.35,19.05 v142.88,19.53 | v137.95,23.18 v140.97,23.18 | v99.38,23.65 99.38,24.29 98.42,25.24 96.84,25.24 92.08,20.48 92.08,19.84 91.28,19.05 88.11,19.05 85.57,21.59 76.04,21.59 v73.18,18.73
  Bottom 0.152: v147.32,15.56 152.24,15.56 152.24,13.18 IC2.19 | v142.88,19.53 142.88,21.27 141.29,21.27 140.97,21.59 v140.97,23.18 | v137.95,23.18 137.79,23.34 134.3,23.34 133.67,23.97 127.95,23.97 127.32,23.34 122.08,23.34 121.13,24.29 100.65,24.29 100.01,23.65 v99.38,23.65 | v73.18,18.73 72.87,18.41 R8.2
N$25  (via drill 0.41)
  Top 0.152: v133.35,3.02 135.25,1.11 143.83,1.11 v152.24,9.53 | v126.84,10.16 v128.91,8.1
  Bottom 0.152: v152.24,9.53 152.24,10.48 151.61,11.11 151.61,13.02 IC2.20 | v133.35,3.02 133.35,5.87 131.76,5.87 129.54,8.1 v128.91,8.1 | v126.84,10.16 124.78,12.22 120.02,12.22 119.22,11.43 116.05,11.43 115.89,11.59 109.22,11.59 109.06,11.43 106.68,11.43 106.36,11.75 101.76,11.75 101.44,11.43 76.04,11.43 72.87,14.61 R7.2
N$26  (via drill 0.41)
  Top 0.152: v147.96,14.92 147.96,16.51 v145.73,18.73 | v145.73,20.48 141.29,24.92 127.48,24.92 v123.67,21.11 | v120.02,21.11 119.7,21.11 119.22,21.59 115.09,21.59 106.68,13.18 106.68,10.79 106.36,10.48 103.98,10.48 103.03,11.43 93.82,11.43 90.96,14.29 90.33,14.29 86.84,17.78 60.48,17.78 v59.53,18.73
  Bottom 0.152: v147.96,14.92 150.81,14.92 150.81,13.18 IC2.21 | v145.73,20.48 v145.73,18.73 | v120.02,21.11 v123.67,21.11 | v59.53,18.73 59.21,18.41 R6.2
N$27  (via drill 0.41)
  Top 0.152: v150.65,12.06 151.13,12.06 154.31,15.24 159.54,15.24 159.7,15.08 160.34,15.08 160.66,15.4 160.66,17.94 155.42,23.18 155.42,24.29 153.83,25.88 127.95,25.88 123.83,21.75 v123.03,21.75 | v61.44,21.59 58.9,19.05 58.9,16.03 v59.05,15.88
  Bottom 0.152: v150.65,12.06 150.34,12.06 150.34,13.02 IC2.22 | v123.03,21.75 99.06,21.75 98.74,21.43 91.44,21.43 91.28,21.59 v61.44,21.59 | v59.05,15.88 57.78,14.61 R5.2

### Text on the board
_bsilk: PCB-BI8-1x10SC3, v03-16 | 1